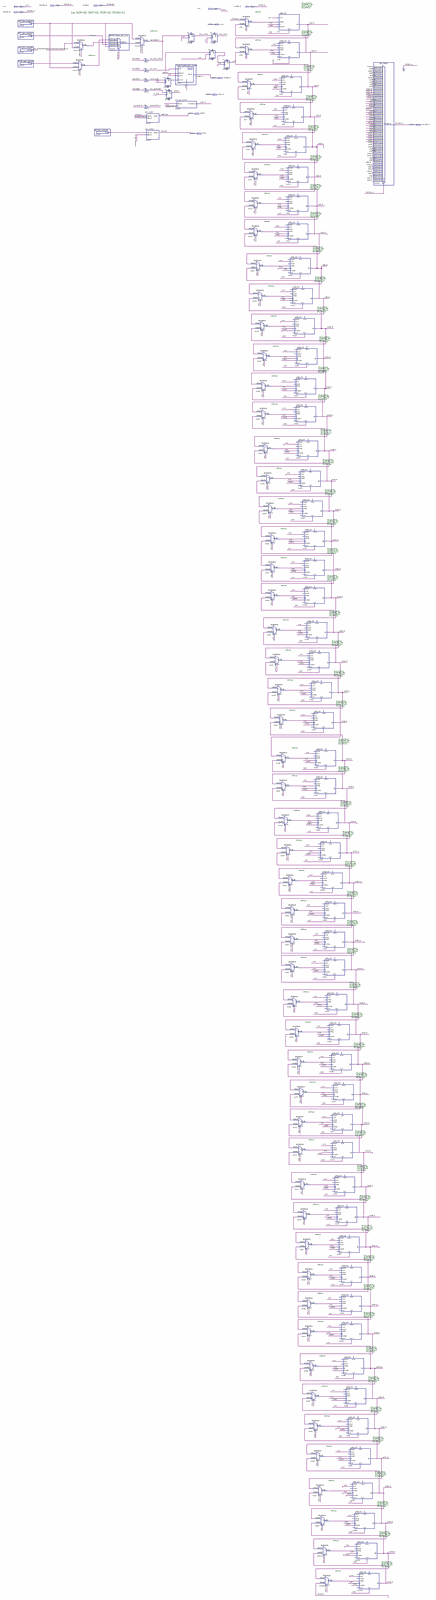
[diagram p0: schematic sheet, whole]
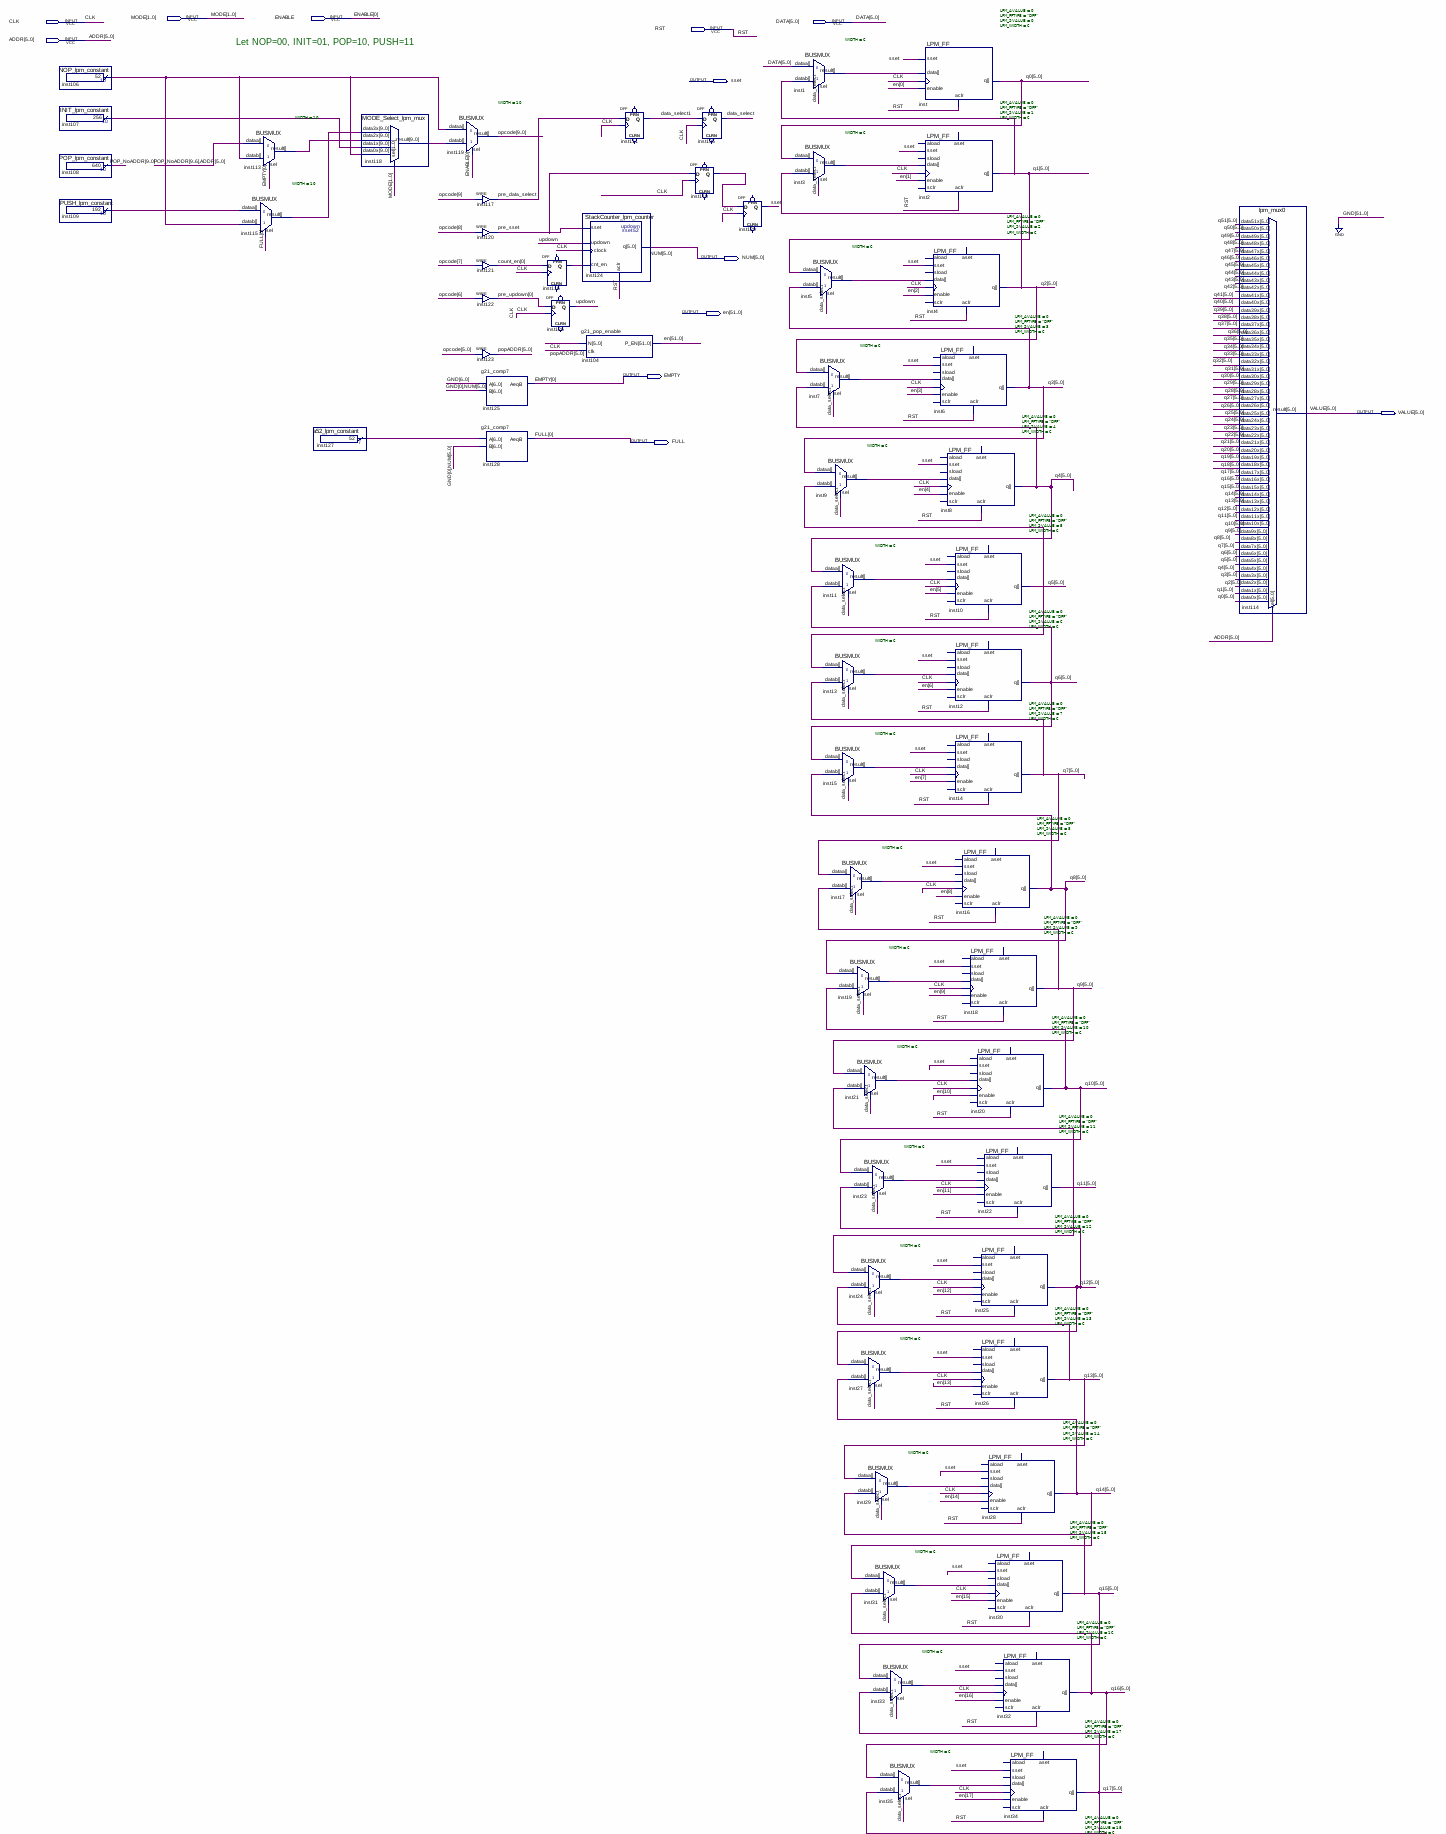
[diagram p1: schematic sheet, upper part]
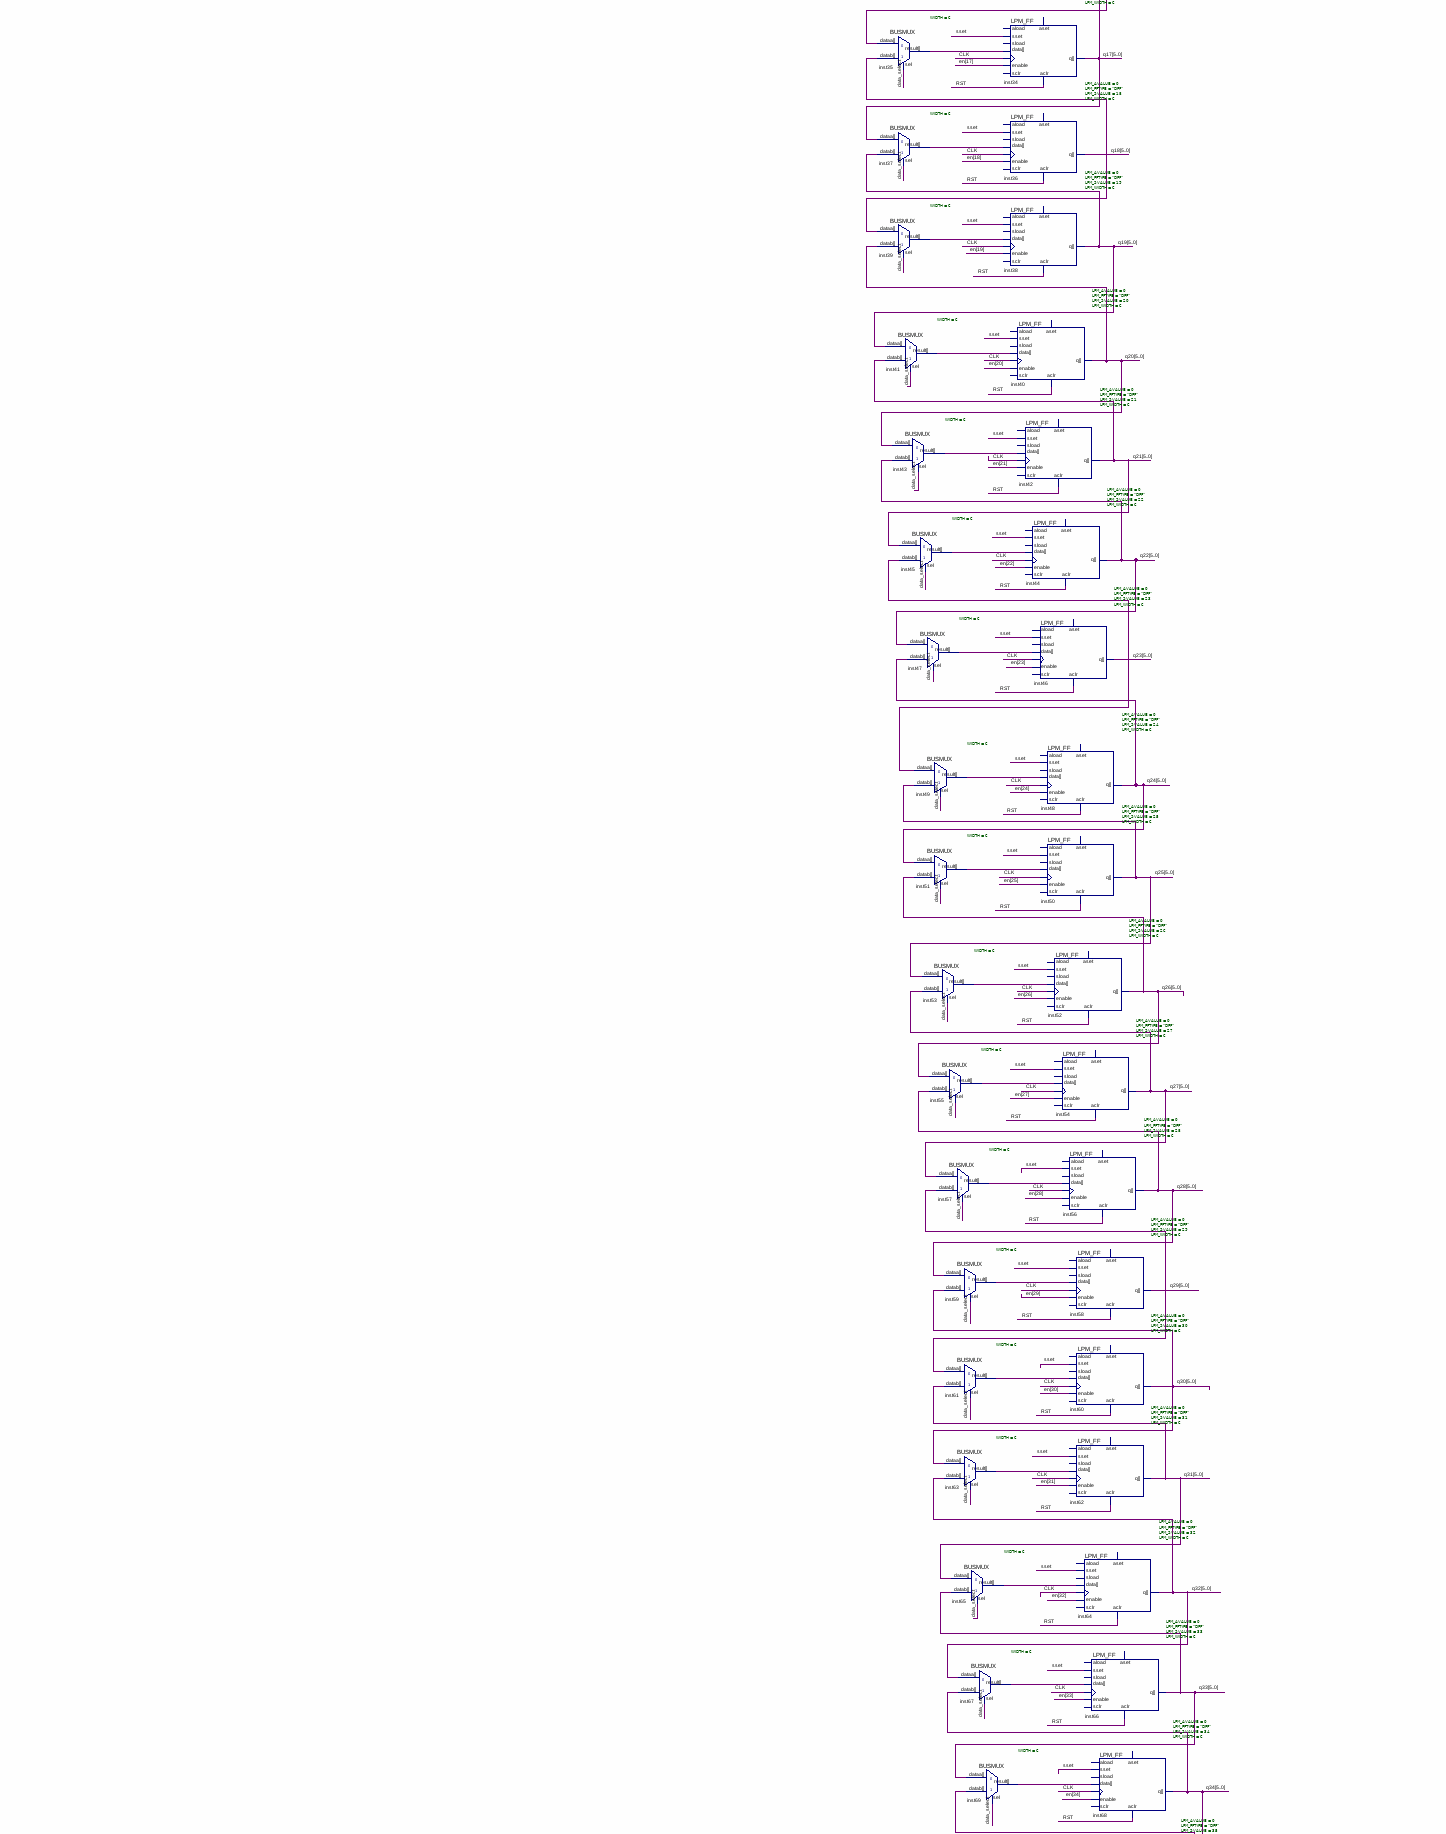
[diagram p2: schematic sheet, middle part]
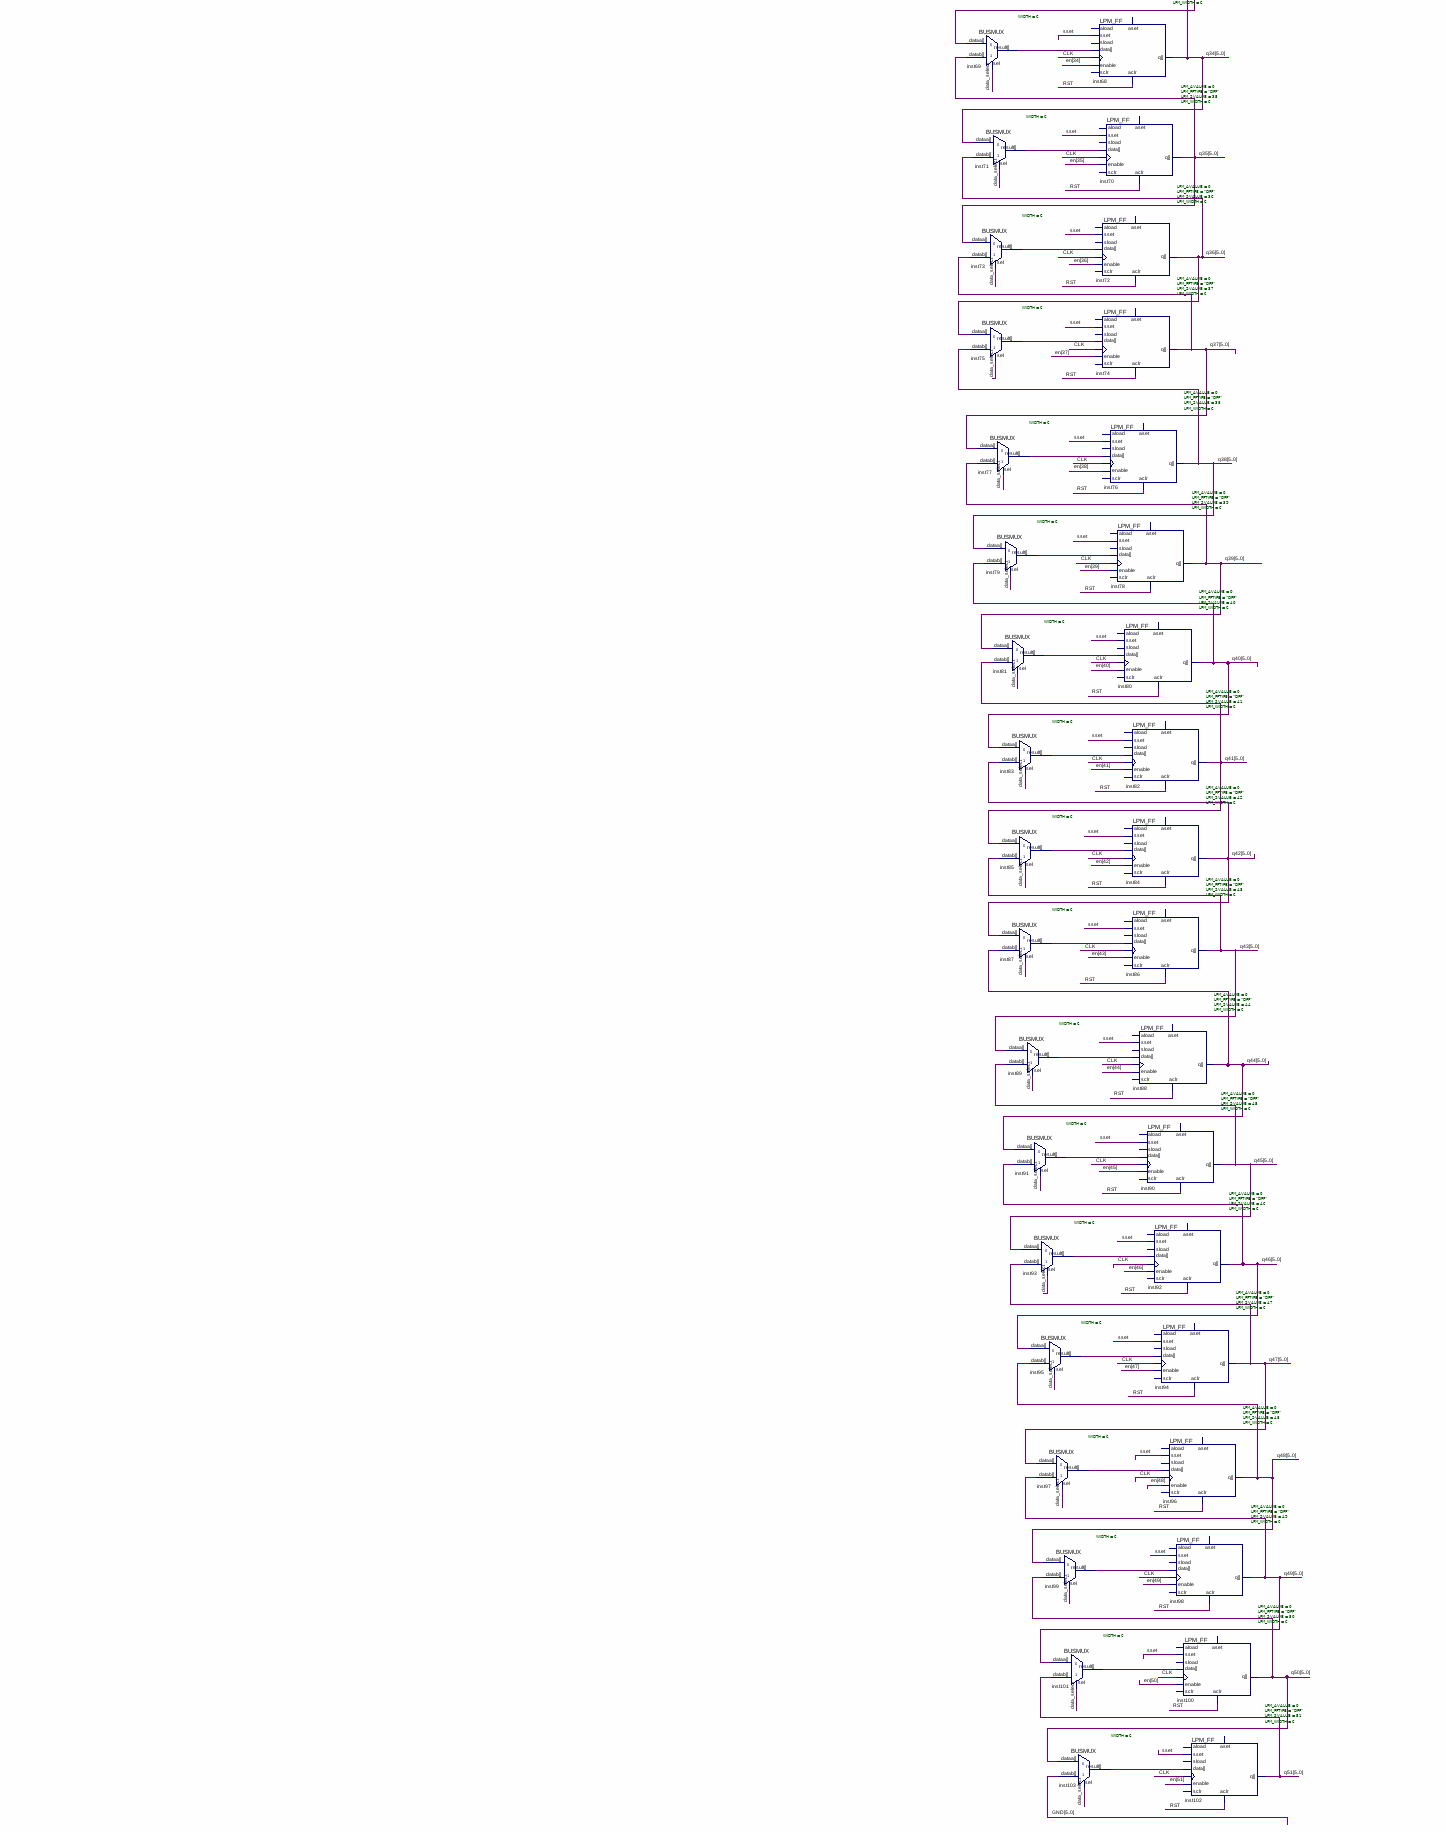
[diagram p3: schematic sheet, lower part]
// Quartus schematic g21_stack52.bdf as structural Verilog: 129 symbols, 12 pins
module g21_stack52 (
  input  [1:0] MODE,
  input  ENABLE,
  input  CLK,
  input  [5:0] DATA,
  input  RST,
  input  [5:0] ADDR,
  output sset,
  output [5:0] NUM,
  output [51:0] en,
  output EMPTY,
  output [5:0] VALUE,
  output FULL
);

  wire data_select, data_select1, inst110_q, inst116_q, pre_data_select, pre_sset, updown;
  wire [0:0] count_en, pre_updown;
  wire [5:0] inst1_result, inst3_result, inst5_result, inst7_result, inst9_result, inst11_result,
       inst13_result, inst15_result, inst17_result, inst19_result, inst21_result, inst23_result,
       inst24_result, inst27_result, inst29_result, inst31_result, inst33_result, inst35_result,
       inst37_result, inst39_result, inst41_result, inst43_result, inst45_result, inst47_result,
       inst49_result, inst51_result, inst53_result, inst55_result, inst57_result, inst59_result,
       inst61_result, inst63_result, inst65_result, inst67_result, inst69_result, inst71_result,
       inst73_result, inst75_result, inst77_result, inst79_result, inst81_result, inst83_result,
       inst85_result, inst87_result, inst89_result, inst91_result, inst93_result, inst95_result,
       inst97_result, inst99_result, inst101_result, inst103_result, popADDR, q0, q1, q2, q3, q4, q5, q6, q7,
       q8, q9, q10, q11, q12, q13, q14, q15, q16, q17, q18, q19, q20, q21, q22, q23, q24, q25, q26, q27, q28,
       q29, q30, q31, q32, q33, q34, q35, q36, q37, q38, q39, q40, q41, q42, q43, q44, q45, q46, q47, q48,
       q49, q50, q51;
  wire [6:0] inst127_result;
  wire [9:0] inst106_result, inst107_result, inst109_result, inst113_result, inst115_result, inst118_result,
       opcode, POP_NoADDR;

  NOP_lpm_constant inst106 (.result(inst106_result));
  INIT_lpm_constant inst107 (.result(inst107_result));
  POP_lpm_constant inst108 (.result(POP_NoADDR));
  PUSH_lpm_constant inst109 (.result(inst109_result));
  BUSMUX #(.WIDTH(10)) inst113 (
    .datab(inst106_result), .sel(EMPTY), .dataa({POP_NoADDR[9:6], ADDR}), .result(inst113_result));
  BUSMUX #(.WIDTH(10)) inst115 (.datab(inst106_result), .sel(FULL), .dataa(inst109_result), .result(inst115_result));
  a52_lpm_constant inst127 (.result(inst127_result));
  MODE_Select_lpm_mux inst118 (
    .data3x(inst115_result), .data2x(inst113_result), .data1x(inst107_result), .data0x(inst106_result),
    .sel(MODE), .result(inst118_result));
  BUSMUX #(.WIDTH(10)) inst119 (.datab(inst118_result), .sel(ENABLE), .dataa(inst106_result), .result(opcode));
  assign pre_data_select = opcode[9];  // WIRE inst117
  assign pre_sset = opcode[8];  // WIRE inst120
  assign count_en[0] = opcode[7];  // WIRE inst121
  assign pre_updown[0] = opcode[6];  // WIRE inst122
  assign popADDR = opcode[5:0];  // WIRE inst123
  g21_comp7 inst125 (.A({7{1'b0}}), .B({1'b0, NUM}), .AeqB(EMPTY));
  g21_comp7 inst128 (.A(inst127_result), .B({1'b0, NUM}), .AeqB(FULL));
  DFF inst116 (.CLK(CLK), .D(count_en[0]), .Q(inst116_q));  // open: CLRN, PRN
  DFF inst126 (.CLK(CLK), .D(pre_updown[0]), .Q(updown));  // open: CLRN, PRN
  StackCounter_lpm_counter inst124 (
    .sset(pre_sset), .updown(updown), .clock(CLK), .cnt_en(inst116_q), .aclr(RST), .q(NUM));
  g21_pop_enable inst104 (.N(popADDR), .clk(CLK), .P_EN(en));
  DFF inst111 (.CLK(CLK), .D(pre_data_select), .Q(data_select1));  // open: CLRN, PRN
  DFF inst105 (.CLK(CLK), .D(data_select1), .Q(data_select));  // open: CLRN, PRN
  DFF inst110 (.CLK(CLK), .D(pre_sset), .Q(inst110_q));  // open: CLRN, PRN
  DFF inst129 (.CLK(CLK), .D(inst110_q), .Q(sset));  // open: CLRN, PRN
  BUSMUX #(.WIDTH(6)) inst1 (.datab(q1), .sel(data_select), .dataa(DATA), .result(inst1_result));
  BUSMUX #(.WIDTH(6)) inst3 (.datab(q2), .sel(data_select), .dataa(q0), .result(inst3_result));
  BUSMUX #(.WIDTH(6)) inst5 (.datab(q3), .sel(data_select), .dataa(q1), .result(inst5_result));
  BUSMUX #(.WIDTH(6)) inst7 (.datab(q4), .sel(data_select), .dataa(q2), .result(inst7_result));
  BUSMUX #(.WIDTH(6)) inst9 (.datab(q5), .sel(data_select), .dataa(q3), .result(inst9_result));
  BUSMUX #(.WIDTH(6)) inst11 (.datab(q6), .sel(data_select), .dataa(q4), .result(inst11_result));
  BUSMUX #(.WIDTH(6)) inst13 (.datab(q7), .sel(data_select), .dataa(q5), .result(inst13_result));
  BUSMUX #(.WIDTH(6)) inst15 (.datab(q8), .sel(data_select), .dataa(q6), .result(inst15_result));
  BUSMUX #(.WIDTH(6)) inst17 (.datab(q9), .sel(data_select), .dataa(q7), .result(inst17_result));
  BUSMUX #(.WIDTH(6)) inst19 (.datab(q10), .sel(data_select), .dataa(q8), .result(inst19_result));
  BUSMUX #(.WIDTH(6)) inst21 (.datab(q11), .sel(data_select), .dataa(q9), .result(inst21_result));
  BUSMUX #(.WIDTH(6)) inst23 (.datab(q12), .sel(data_select), .dataa(q10), .result(inst23_result));
  BUSMUX #(.WIDTH(6)) inst24 (.datab(q13), .sel(data_select), .dataa(q11), .result(inst24_result));
  BUSMUX #(.WIDTH(6)) inst27 (.datab(q14), .sel(data_select), .dataa(q12), .result(inst27_result));
  BUSMUX #(.WIDTH(6)) inst29 (.datab(q15), .sel(data_select), .dataa(q13), .result(inst29_result));
  BUSMUX #(.WIDTH(6)) inst31 (.datab(q16), .sel(data_select), .dataa(q14), .result(inst31_result));
  BUSMUX #(.WIDTH(6)) inst33 (.datab(q17), .sel(data_select), .dataa(q15), .result(inst33_result));
  BUSMUX #(.WIDTH(6)) inst35 (.datab(q18), .sel(data_select), .dataa(q16), .result(inst35_result));
  BUSMUX #(.WIDTH(6)) inst37 (.datab(q19), .sel(data_select), .dataa(q17), .result(inst37_result));
  BUSMUX #(.WIDTH(6)) inst39 (.datab(q20), .sel(data_select), .dataa(q18), .result(inst39_result));
  BUSMUX #(.WIDTH(6)) inst41 (.datab(q21), .sel(data_select), .dataa(q19), .result(inst41_result));
  BUSMUX #(.WIDTH(6)) inst43 (.datab(q22), .sel(data_select), .dataa(q20), .result(inst43_result));
  LPM_FF #(.LPM_AVALUE(0), .LPM_FFTYPE("DFF"), .LPM_SVALUE(0), .LPM_WIDTH(6)) inst (
    .aclr(RST), .clock(CLK), .data(inst1_result), .enable(en[0]), .sset(sset), .q(q0));
  LPM_FF #(.LPM_AVALUE(0), .LPM_FFTYPE("DFF"), .LPM_SVALUE(1), .LPM_WIDTH(6)) inst2 (
    .enable(en[1]), .clock(CLK), .sset(sset), .aclr(RST), .data(inst3_result), .q(q1));  // open: aload, sload, aset, sclr
  BUSMUX #(.WIDTH(6)) inst45 (.datab(q23), .sel(data_select), .dataa(q21), .result(inst45_result));
  BUSMUX #(.WIDTH(6)) inst47 (.datab(q24), .sel(data_select), .dataa(q22), .result(inst47_result));
  BUSMUX #(.WIDTH(6)) inst49 (.datab(q25), .sel(data_select), .dataa(q23), .result(inst49_result));
  BUSMUX #(.WIDTH(6)) inst51 (.datab(q26), .sel(data_select), .dataa(q24), .result(inst51_result));
  BUSMUX #(.WIDTH(6)) inst53 (.datab(q27), .sel(data_select), .dataa(q25), .result(inst53_result));
  LPM_FF #(.LPM_AVALUE(0), .LPM_FFTYPE("DFF"), .LPM_SVALUE(2), .LPM_WIDTH(6)) inst4 (
    .enable(en[2]), .clock(CLK), .sset(sset), .aclr(RST), .data(inst5_result), .q(q2));  // open: aload, sload, aset, sclr
  LPM_FF #(.LPM_AVALUE(0), .LPM_FFTYPE("DFF"), .LPM_SVALUE(3), .LPM_WIDTH(6)) inst6 (
    .enable(en[3]), .clock(CLK), .sset(sset), .aclr(RST), .data(inst7_result), .q(q3));  // open: aload, sload, aset, sclr
  LPM_FF #(.LPM_AVALUE(0), .LPM_FFTYPE("DFF"), .LPM_SVALUE(4), .LPM_WIDTH(6)) inst8 (
    .enable(en[4]), .clock(CLK), .sset(sset), .aclr(RST), .data(inst9_result), .q(q4));  // open: aload, sload, aset, sclr
  LPM_FF #(.LPM_AVALUE(0), .LPM_FFTYPE("DFF"), .LPM_SVALUE(5), .LPM_WIDTH(6)) inst10 (
    .enable(en[5]), .clock(CLK), .sset(sset), .aclr(RST), .data(inst11_result), .q(q5));  // open: aload, sload, aset, sclr
  LPM_FF #(.LPM_AVALUE(0), .LPM_FFTYPE("DFF"), .LPM_SVALUE(6), .LPM_WIDTH(6)) inst12 (
    .enable(en[6]), .clock(CLK), .sset(sset), .aclr(RST), .data(inst13_result), .q(q6));  // open: aload, sload, aset, sclr
  LPM_FF #(.LPM_AVALUE(0), .LPM_FFTYPE("DFF"), .LPM_SVALUE(7), .LPM_WIDTH(6)) inst14 (
    .enable(en[7]), .clock(CLK), .sset(sset), .aclr(RST), .data(inst15_result), .q(q7));  // open: aload, sload, aset, sclr
  BUSMUX #(.WIDTH(6)) inst55 (.datab(q28), .sel(data_select), .dataa(q26), .result(inst55_result));
  BUSMUX #(.WIDTH(6)) inst57 (.datab(q29), .sel(data_select), .dataa(q27), .result(inst57_result));
  BUSMUX #(.WIDTH(6)) inst59 (.datab(q30), .sel(data_select), .dataa(q28), .result(inst59_result));
  BUSMUX #(.WIDTH(6)) inst61 (.datab(q31), .sel(data_select), .dataa(q29), .result(inst61_result));
  BUSMUX #(.WIDTH(6)) inst63 (.datab(q32), .sel(data_select), .dataa(q30), .result(inst63_result));
  BUSMUX #(.WIDTH(6)) inst65 (.datab(q33), .sel(data_select), .dataa(q31), .result(inst65_result));
  LPM_FF #(.LPM_AVALUE(0), .LPM_FFTYPE("DFF"), .LPM_SVALUE(8), .LPM_WIDTH(6)) inst16 (
    .enable(en[8]), .clock(CLK), .sset(sset), .aclr(RST), .data(inst17_result), .q(q8));  // open: aload, sload, aset, sclr
  LPM_FF #(.LPM_AVALUE(0), .LPM_FFTYPE("DFF"), .LPM_SVALUE(9), .LPM_WIDTH(6)) inst18 (
    .enable(en[9]), .clock(CLK), .sset(sset), .aclr(RST), .data(inst19_result), .q(q9));  // open: aload, sload, aset, sclr
  LPM_FF #(.LPM_AVALUE(0), .LPM_FFTYPE("DFF"), .LPM_SVALUE(10), .LPM_WIDTH(6)) inst20 (
    .enable(en[10]), .clock(CLK), .sset(sset), .aclr(RST), .data(inst21_result), .q(q10));  // open: aload, sload, aset, sclr
  LPM_FF #(.LPM_AVALUE(0), .LPM_FFTYPE("DFF"), .LPM_SVALUE(11), .LPM_WIDTH(6)) inst22 (
    .enable(en[11]), .clock(CLK), .sset(sset), .aclr(RST), .data(inst23_result), .q(q11));  // open: aload, sload, aset, sclr
  LPM_FF #(.LPM_AVALUE(0), .LPM_FFTYPE("DFF"), .LPM_SVALUE(12), .LPM_WIDTH(6)) inst25 (
    .enable(en[12]), .clock(CLK), .sset(sset), .aclr(RST), .data(inst24_result), .q(q12));  // open: aload, sload, aset, sclr
  LPM_FF #(.LPM_AVALUE(0), .LPM_FFTYPE("DFF"), .LPM_SVALUE(13), .LPM_WIDTH(6)) inst26 (
    .enable(en[13]), .clock(CLK), .sset(sset), .aclr(RST), .data(inst27_result), .q(q13));  // open: aload, sload, aset, sclr
  LPM_FF #(.LPM_AVALUE(0), .LPM_FFTYPE("DFF"), .LPM_SVALUE(14), .LPM_WIDTH(6)) inst28 (
    .enable(en[14]), .clock(CLK), .sset(sset), .aclr(RST), .data(inst29_result), .q(q14));  // open: aload, sload, aset, sclr
  BUSMUX #(.WIDTH(6)) inst67 (.datab(q34), .sel(data_select), .dataa(q32), .result(inst67_result));
  BUSMUX #(.WIDTH(6)) inst69 (.datab(q35), .sel(data_select), .dataa(q33), .result(inst69_result));
  BUSMUX #(.WIDTH(6)) inst71 (.datab(q36), .sel(data_select), .dataa(q34), .result(inst71_result));
  BUSMUX #(.WIDTH(6)) inst73 (.datab(q37), .sel(data_select), .dataa(q35), .result(inst73_result));
  BUSMUX #(.WIDTH(6)) inst75 (.datab(q38), .sel(data_select), .dataa(q36), .result(inst75_result));
  BUSMUX #(.WIDTH(6)) inst77 (.datab(q39), .sel(data_select), .dataa(q37), .result(inst77_result));
  LPM_FF #(.LPM_AVALUE(0), .LPM_FFTYPE("DFF"), .LPM_SVALUE(15), .LPM_WIDTH(6)) inst30 (
    .enable(en[15]), .clock(CLK), .sset(sset), .aclr(RST), .data(inst31_result), .q(q15));  // open: aload, sload, aset, sclr
  LPM_FF #(.LPM_AVALUE(0), .LPM_FFTYPE("DFF"), .LPM_SVALUE(16), .LPM_WIDTH(6)) inst32 (
    .enable(en[16]), .clock(CLK), .sset(sset), .aclr(RST), .data(inst33_result), .q(q16));  // open: aload, sload, aset, sclr
  LPM_FF #(.LPM_AVALUE(0), .LPM_FFTYPE("DFF"), .LPM_SVALUE(17), .LPM_WIDTH(6)) inst34 (
    .enable(en[17]), .clock(CLK), .sset(sset), .aclr(RST), .data(inst35_result), .q(q17));  // open: aload, sload, aset, sclr
  LPM_FF #(.LPM_AVALUE(0), .LPM_FFTYPE("DFF"), .LPM_SVALUE(18), .LPM_WIDTH(6)) inst36 (
    .enable(en[18]), .clock(CLK), .sset(sset), .aclr(RST), .data(inst37_result), .q(q18));  // open: aload, sload, aset, sclr
  LPM_FF #(.LPM_AVALUE(0), .LPM_FFTYPE("DFF"), .LPM_SVALUE(19), .LPM_WIDTH(6)) inst38 (
    .enable(en[19]), .clock(CLK), .sset(sset), .aclr(RST), .data(inst39_result), .q(q19));  // open: aload, sload, aset, sclr
  LPM_FF #(.LPM_AVALUE(0), .LPM_FFTYPE("DFF"), .LPM_SVALUE(20), .LPM_WIDTH(6)) inst40 (
    .enable(en[20]), .clock(CLK), .sset(sset), .aclr(RST), .data(inst41_result), .q(q20));  // open: aload, sload, aset, sclr
  BUSMUX #(.WIDTH(6)) inst79 (.datab(q40), .sel(data_select), .dataa(q38), .result(inst79_result));
  BUSMUX #(.WIDTH(6)) inst81 (.datab(q41), .sel(data_select), .dataa(q39), .result(inst81_result));
  BUSMUX #(.WIDTH(6)) inst83 (.datab(q42), .sel(data_select), .dataa(q40), .result(inst83_result));
  BUSMUX #(.WIDTH(6)) inst85 (.datab(q43), .sel(data_select), .dataa(q41), .result(inst85_result));
  BUSMUX #(.WIDTH(6)) inst87 (.datab(q44), .sel(data_select), .dataa(q42), .result(inst87_result));
  BUSMUX #(.WIDTH(6)) inst89 (.datab(q45), .sel(data_select), .dataa(q43), .result(inst89_result));
  LPM_FF #(.LPM_AVALUE(0), .LPM_FFTYPE("DFF"), .LPM_SVALUE(21), .LPM_WIDTH(6)) inst42 (
    .enable(en[21]), .clock(CLK), .sset(sset), .aclr(RST), .data(inst43_result), .q(q21));  // open: aload, sload, aset, sclr
  LPM_FF #(.LPM_AVALUE(0), .LPM_FFTYPE("DFF"), .LPM_SVALUE(22), .LPM_WIDTH(6)) inst44 (
    .enable(en[22]), .clock(CLK), .sset(sset), .aclr(RST), .data(inst45_result), .q(q22));  // open: aload, sload, aset, sclr
  LPM_FF #(.LPM_AVALUE(0), .LPM_FFTYPE("DFF"), .LPM_SVALUE(23), .LPM_WIDTH(6)) inst46 (
    .enable(en[23]), .clock(CLK), .sset(sset), .aclr(RST), .data(inst47_result), .q(q23));  // open: aload, sload, aset, sclr
  LPM_FF #(.LPM_AVALUE(0), .LPM_FFTYPE("DFF"), .LPM_SVALUE(24), .LPM_WIDTH(6)) inst48 (
    .enable(en[24]), .clock(CLK), .sset(sset), .aclr(RST), .data(inst49_result), .q(q24));  // open: aload, sload, aset, sclr
  LPM_FF #(.LPM_AVALUE(0), .LPM_FFTYPE("DFF"), .LPM_SVALUE(25), .LPM_WIDTH(6)) inst50 (
    .enable(en[25]), .clock(CLK), .sset(sset), .aclr(RST), .data(inst51_result), .q(q25));  // open: aload, sload, aset, sclr
  BUSMUX #(.WIDTH(6)) inst91 (.datab(q46), .sel(data_select), .dataa(q44), .result(inst91_result));
  BUSMUX #(.WIDTH(6)) inst93 (.datab(q47), .sel(data_select), .dataa(q45), .result(inst93_result));
  BUSMUX #(.WIDTH(6)) inst95 (.datab(q48), .sel(data_select), .dataa(q46), .result(inst95_result));
  BUSMUX #(.WIDTH(6)) inst97 (.datab(q49), .sel(data_select), .dataa(q47), .result(inst97_result));
  LPM_FF #(.LPM_AVALUE(0), .LPM_FFTYPE("DFF"), .LPM_SVALUE(26), .LPM_WIDTH(6)) inst52 (
    .enable(en[26]), .clock(CLK), .sset(sset), .aclr(RST), .data(inst53_result), .q(q26));  // open: aload, sload, aset, sclr
  LPM_FF #(.LPM_AVALUE(0), .LPM_FFTYPE("DFF"), .LPM_SVALUE(27), .LPM_WIDTH(6)) inst54 (
    .enable(en[27]), .clock(CLK), .sset(sset), .aclr(RST), .data(inst55_result), .q(q27));  // open: aload, sload, aset, sclr
  LPM_FF #(.LPM_AVALUE(0), .LPM_FFTYPE("DFF"), .LPM_SVALUE(28), .LPM_WIDTH(6)) inst56 (
    .enable(en[28]), .clock(CLK), .sset(sset), .aclr(RST), .data(inst57_result), .q(q28));  // open: aload, sload, aset, sclr
  LPM_FF #(.LPM_AVALUE(0), .LPM_FFTYPE("DFF"), .LPM_SVALUE(29), .LPM_WIDTH(6)) inst58 (
    .enable(en[29]), .clock(CLK), .sset(sset), .aclr(RST), .data(inst59_result), .q(q29));  // open: aload, sload, aset, sclr
  LPM_FF #(.LPM_AVALUE(0), .LPM_FFTYPE("DFF"), .LPM_SVALUE(30), .LPM_WIDTH(6)) inst60 (
    .enable(en[30]), .clock(CLK), .sset(sset), .aclr(RST), .data(inst61_result), .q(q30));  // open: aload, sload, aset, sclr
  LPM_FF #(.LPM_AVALUE(0), .LPM_FFTYPE("DFF"), .LPM_SVALUE(31), .LPM_WIDTH(6)) inst62 (
    .enable(en[31]), .clock(CLK), .sset(sset), .aclr(RST), .data(inst63_result), .q(q31));  // open: aload, sload, aset, sclr
  BUSMUX #(.WIDTH(6)) inst99 (.datab(q50), .sel(data_select), .dataa(q48), .result(inst99_result));
  BUSMUX #(.WIDTH(6)) inst101 (.datab(q51), .sel(data_select), .dataa(q49), .result(inst101_result));
  BUSMUX #(.WIDTH(6)) inst103 (.datab({6{1'b0}}), .sel(data_select), .dataa(q50), .result(inst103_result));
  LPM_FF #(.LPM_AVALUE(0), .LPM_FFTYPE("DFF"), .LPM_SVALUE(32), .LPM_WIDTH(6)) inst64 (
    .enable(en[32]), .clock(CLK), .sset(sset), .aclr(RST), .data(inst65_result), .q(q32));  // open: aload, sload, aset, sclr
  LPM_FF #(.LPM_AVALUE(0), .LPM_FFTYPE("DFF"), .LPM_SVALUE(33), .LPM_WIDTH(6)) inst66 (
    .enable(en[33]), .clock(CLK), .sset(sset), .aclr(RST), .data(inst67_result), .q(q33));  // open: aload, sload, aset, sclr
  LPM_FF #(.LPM_AVALUE(0), .LPM_FFTYPE("DFF"), .LPM_SVALUE(34), .LPM_WIDTH(6)) inst68 (
    .enable(en[34]), .clock(CLK), .sset(sset), .aclr(RST), .data(inst69_result), .q(q34));  // open: aload, sload, aset, sclr
  LPM_FF #(.LPM_AVALUE(0), .LPM_FFTYPE("DFF"), .LPM_SVALUE(35), .LPM_WIDTH(6)) inst70 (
    .enable(en[35]), .clock(CLK), .sset(sset), .aclr(RST), .data(inst71_result), .q(q35));  // open: aload, sload, aset, sclr
  LPM_FF #(.LPM_AVALUE(0), .LPM_FFTYPE("DFF"), .LPM_SVALUE(36), .LPM_WIDTH(6)) inst72 (
    .enable(en[36]), .clock(CLK), .sset(sset), .aclr(RST), .data(inst73_result), .q(q36));  // open: aload, sload, aset, sclr
  LPM_FF #(.LPM_AVALUE(0), .LPM_FFTYPE("DFF"), .LPM_SVALUE(37), .LPM_WIDTH(6)) inst74 (
    .enable(en[37]), .clock(CLK), .sset(sset), .aclr(RST), .data(inst75_result), .q(q37));  // open: aload, sload, aset, sclr
  LPM_FF #(.LPM_AVALUE(0), .LPM_FFTYPE("DFF"), .LPM_SVALUE(38), .LPM_WIDTH(6)) inst76 (
    .enable(en[38]), .clock(CLK), .sset(sset), .aclr(RST), .data(inst77_result), .q(q38));  // open: aload, sload, aset, sclr
  LPM_FF #(.LPM_AVALUE(0), .LPM_FFTYPE("DFF"), .LPM_SVALUE(39), .LPM_WIDTH(6)) inst78 (
    .enable(en[39]), .clock(CLK), .sset(sset), .aclr(RST), .data(inst79_result), .q(q39));  // open: aload, sload, aset, sclr
  LPM_FF #(.LPM_AVALUE(0), .LPM_FFTYPE("DFF"), .LPM_SVALUE(40), .LPM_WIDTH(6)) inst80 (
    .enable(en[40]), .clock(CLK), .sset(sset), .aclr(RST), .data(inst81_result), .q(q40));  // open: aload, sload, aset, sclr
  LPM_FF #(.LPM_AVALUE(0), .LPM_FFTYPE("DFF"), .LPM_SVALUE(41), .LPM_WIDTH(6)) inst82 (
    .enable(en[41]), .clock(CLK), .sset(sset), .aclr(RST), .data(inst83_result), .q(q41));  // open: aload, sload, aset, sclr
  LPM_FF #(.LPM_AVALUE(0), .LPM_FFTYPE("DFF"), .LPM_SVALUE(42), .LPM_WIDTH(6)) inst84 (
    .enable(en[42]), .clock(CLK), .sset(sset), .aclr(RST), .data(inst85_result), .q(q42));  // open: aload, sload, aset, sclr
  LPM_FF #(.LPM_AVALUE(0), .LPM_FFTYPE("DFF"), .LPM_SVALUE(43), .LPM_WIDTH(6)) inst86 (
    .enable(en[43]), .clock(CLK), .sset(sset), .aclr(RST), .data(inst87_result), .q(q43));  // open: aload, sload, aset, sclr
  LPM_FF #(.LPM_AVALUE(0), .LPM_FFTYPE("DFF"), .LPM_SVALUE(44), .LPM_WIDTH(6)) inst88 (
    .enable(en[44]), .clock(CLK), .sset(sset), .aclr(RST), .data(inst89_result), .q(q44));  // open: aload, sload, aset, sclr
  LPM_FF #(.LPM_AVALUE(0), .LPM_FFTYPE("DFF"), .LPM_SVALUE(45), .LPM_WIDTH(6)) inst90 (
    .enable(en[45]), .clock(CLK), .sset(sset), .aclr(RST), .data(inst91_result), .q(q45));  // open: aload, sload, aset, sclr
  LPM_FF #(.LPM_AVALUE(0), .LPM_FFTYPE("DFF"), .LPM_SVALUE(46), .LPM_WIDTH(6)) inst92 (
    .enable(en[46]), .clock(CLK), .sset(sset), .aclr(RST), .data(inst93_result), .q(q46));  // open: aload, sload, aset, sclr
  LPM_FF #(.LPM_AVALUE(0), .LPM_FFTYPE("DFF"), .LPM_SVALUE(47), .LPM_WIDTH(6)) inst94 (
    .enable(en[47]), .clock(CLK), .sset(sset), .aclr(RST), .data(inst95_result), .q(q47));  // open: aload, sload, aset, sclr
  LPM_FF #(.LPM_AVALUE(0), .LPM_FFTYPE("DFF"), .LPM_SVALUE(48), .LPM_WIDTH(6)) inst96 (
    .enable(en[48]), .clock(CLK), .sset(sset), .aclr(RST), .data(inst97_result), .q(q48));  // open: aload, sload, aset, sclr
  LPM_FF #(.LPM_AVALUE(0), .LPM_FFTYPE("DFF"), .LPM_SVALUE(49), .LPM_WIDTH(6)) inst98 (
    .enable(en[49]), .clock(CLK), .sset(sset), .aclr(RST), .data(inst99_result), .q(q49));  // open: aload, sload, aset, sclr
  LPM_FF #(.LPM_AVALUE(0), .LPM_FFTYPE("DFF"), .LPM_SVALUE(50), .LPM_WIDTH(6)) inst100 (
    .enable(en[50]), .clock(CLK), .sset(sset), .aclr(RST), .data(inst101_result), .q(q50));  // open: aload, sload, aset, sclr
  LPM_FF #(.LPM_AVALUE(0), .LPM_FFTYPE("DFF"), .LPM_SVALUE(51), .LPM_WIDTH(6)) inst102 (
    .enable(en[51]), .clock(CLK), .sset(sset), .aclr(RST), .data(inst103_result), .q(q51));  // open: aload, sload, aset, sclr
  lpm_mux0 inst114 (
    .data51x(q51), .data50x(q50), .data49x(q49), .data48x(q48), .data47x(q47), .data46x(q46), .data45x(q45),
    .data44x(q44), .data43x(q43), .data42x(q42), .data41x(q41), .data40x(q40), .data39x(q39), .data38x(q38),
    .data37x(q37), .data36x(q36), .data35x(q35), .data34x(q34), .data33x(q33), .data32x(q32), .data31x(q31),
    .data30x(q30), .data29x(q29), .data28x(q28), .data27x(q27), .data26x(q26), .data25x(q25), .data24x(q24),
    .data23x(q23), .data22x(q22), .data21x(q21), .data20x(q20), .data19x(q19), .data18x(q18), .data17x(q17),
    .data16x(q16), .data15x(q15), .data14x(q14), .data13x(q13), .data12x(q12), .data11x(q11), .data10x(q10),
    .data9x(q9), .data8x(q8), .data7x(q7), .data6x(q6), .data5x(q5), .data4x(q4), .data3x(q3), .data2x(q2),
    .data1x(q1), .data0x(q0), .sel(ADDR), .result(VALUE));

  // Other names for the same wires on the sheet: EMPTY[0] = EMPTY; ENABLE[0] = ENABLE; FULL[0] = FULL

  // Notes on the sheet:
  //   Let NOP=00, INIT=01, POP=10, PUSH=11 
endmodule
